# EAGLE schematic fe1.1s_schematic (EAGLE 7.1.0)
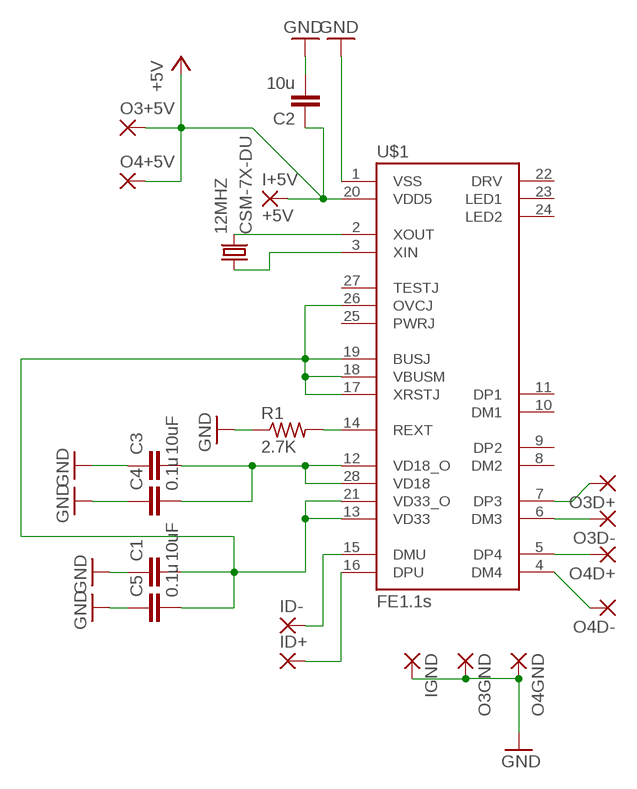
[diagram p0: schematic, sheet 1]

## Parts
12MHZ  CSM-7X-DU  [CSM-7X-DU]
C1  10uF  C-EUC0603  [C0603]
C2  10u  C-EUC0603  [C0603]
C3  10uF  C-EUC0603  [C0603]
C4  0.1u  C-EUC0603  [C0603]
C5  0.1u  C-EUC0603  [C0603]
I+5V  +5V  1,6/0,8  [1,6/0,8]
ID+  1,6/0,8  [1,6/0,8]
ID-  1,6/0,8  [1,6/0,8]
IGND  1,6/0,8  [1,6/0,8]
O3+5V  1,6/0,8  [1,6/0,8]
O3D+  1,6/0,8  [1,6/0,8]
O3D-  1,6/0,8  [1,6/0,8]
O3GND  1,6/0,8  [1,6/0,8]
O4+5V  1,6/0,8  [1,6/0,8]
O4D+  1,6/0,8  [1,6/0,8]
O4D-  1,6/0,8  [1,6/0,8]
O4GND  1,6/0,8  [1,6/0,8]
R1  2.7K  R-US_R0603  [R0603]
U$1  FE1.1S  [FE1.1S_SSOP-28]

## Nets
+5V: C2.1 I+5V.1(P) O3+5V.1(P) O4+5V.1(P) U$1.20(VDD5)
GND: C1.1 C2.2 C3.1 C4.1 C5.1 IGND.1(P) O3GND.1(P) O4GND.1(P) R1.1 U$1.1(VSS)
N$1: 12MHZ.2 U$1.2(XOUT)
N$2: 12MHZ.1 U$1.3(XIN)
N$3: O4D-.1(P) U$1.4(DM4)
N$4: O4D+.1(P) U$1.5(DP4)
N$5: O3D+.1(P) U$1.7(DP3)
N$6: O3D-.1(P) U$1.6(DM3)
N$7: R1.2 U$1.14(REXT)
N$8: ID-.1(P) U$1.15(DMU)
N$9: ID+.1(P) U$1.16(DPU)
N$11: C3.2 C4.2 U$1.12(VD18_O) U$1.28(VD18)
N$12: C1.2 C5.2 U$1.13(VD33) U$1.17(XRSTJ) U$1.18(VBUSM) U$1.19(BUSJ) U$1.21(VD33_O) U$1.26(OVCJ)
Unconnected: U$1.8(DM2) U$1.9(DP2) U$1.10(DM1) U$1.11(DP1) U$1.22(DRV) U$1.23(LED1) U$1.24(LED2) U$1.25(PWRJ) U$1.27(TESTJ)

## Library data of the parts
12MHZ = crystal:CSM-7X-DU: SMD CRYSTAL Source: www.ecsxtal.com .. Crystal 3.6864MHz CSM_7X_DU.PDF; OC_FARNELL: unknown; OC_NEWARK: unknown
C1-C5 = rcl:C-EU: CAPACITOR, European symbol
I+5V ID+ ID- IGND O3+5V O3D+ O3D- O3GND O4+5V O4D+ O4D- O4GND = wirepad:1,6/0,8: THROUGH-HOLE PAD
R1 = resistor:R-US_: RESISTOR, American symbol
U$1 = imcom:FE1.1S: A USB 2.0 hub IC. http://www.jfd-ic.com/Documents/FE1.1s%20Data%20Sheet%20%28Rev.%201.0%29.pdf

## Net classes
0 default: width 0.254 mm, drill 0.254 mm, clearance 0.254 mm